# Altium schematic sheet 4-ADC.SchDoc: RD15002_SingleSCT.PrjPcb
size A4; DrawnBy: 邓勇杰; Revision: A1.0.0; SheetNumber: 5; SheetTotal: 10; Time: 2015/12/2
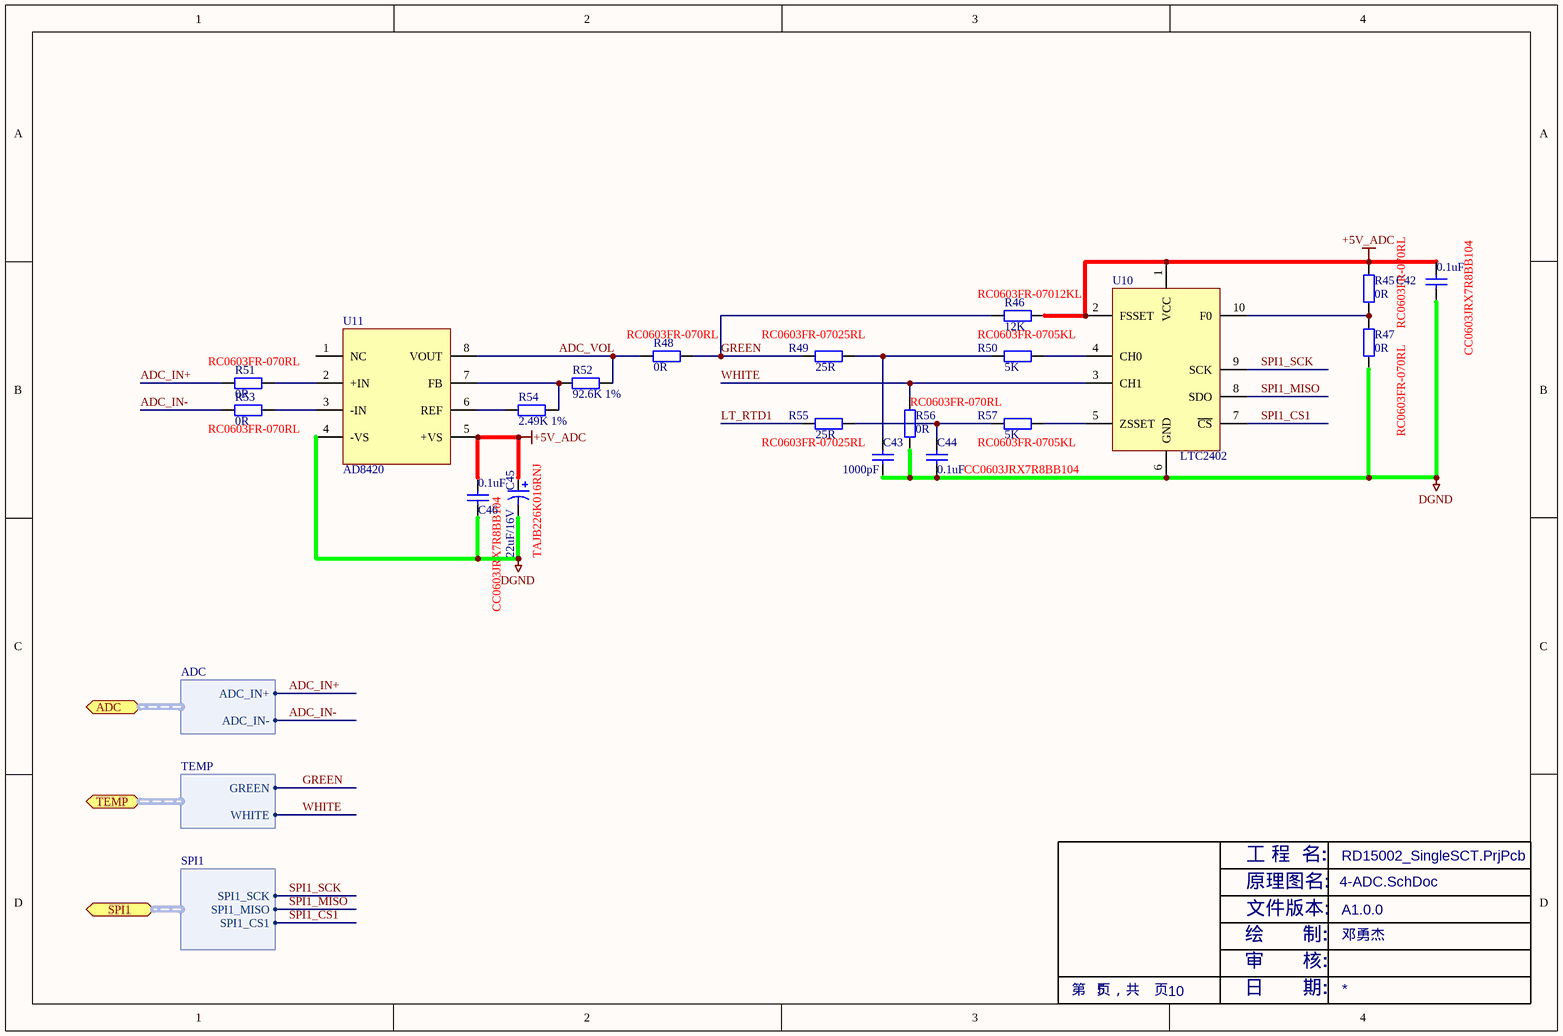
[diagram p0: 4-ADC.SchDoc]

## Parts
C42  0.1uF  Type No.: CC0603JRX7R8BB104  [CC0603]
C43  1000pF  [CC0603]
C44  0.1uF  Type No.: CC0603JRX7R8BB104  [CC0603]
C45  22uF/16V  Part No.: TAJB226K016RNJ  [CB3528]
C46  0.1uF  Type No.: CC0603JRX7R8BB104  [CC0603]
R45  0R  Type No.: RC0603FR-070RL  [CC0603]
R46  12K  Type No.: RC0603FR-07012KL  [CC0603]
R47  0R  Type No.: RC0603FR-070RL  [CC0603]
R48  0R  Type No.: RC0603FR-070RL  [CC0603]
R49  25R  Type No.: RC0603FR-07025RL  [CC0603]
R50  5K  Type No.: RC0603FR-0705KL  [CC0603]
R51  0R  Type No.: RC0603FR-070RL  [CC0603]
R52  92.6K 1%  [CC0603]
R53  0R  Type No.: RC0603FR-070RL  [CC0603]
R54  2.49K 1%  [CC0603]
R55  25R  Type No.: RC0603FR-07025RL  [CC0603]
R56  0R  Type No.: RC0603FR-070RL  [CC0603]
R57  5K  Type No.: RC0603FR-0705KL  [CC0603]
U10  LTC2402  [MS10]
U11  AD8420  [MSOP8]

## Ports
ADC (harness ADC), SPI1 (harness SPI1), TEMP (harness TEMP)

## Harnesses
SPI1: SPI1_SCK, SPI1_MISO, SPI1_CS1
TEMP: GREEN, WHITE
ADC: ADC_IN+, ADC_IN-

## Nets
+5V_ADC: C42.2 C45.1 C46.2 R45.1 R46.1 U10.1(VCC) U10.2(FSSET) U11.5(+VS)
DGND: C42.1 C43.1 C44.1 C45.2 C46.1 R47.2 R56.1 U10.6(GND) U11.4(-VS)
ADC_IN+: R51.1 ; port ADC.ADC_IN+
ADC_IN-: R53.1 ; port ADC.ADC_IN-
ADC_VOL: R48.1 R52.2 U11.8(VOUT)
GREEN: R46.2 R48.2 R49.1 ; port TEMP.GREEN
LT_RTD1: R55.1
SPI1_CS1: U10.7(~{CS}) ; port SPI1.SPI1_CS1
SPI1_MISO: U10.8(SDO) ; port SPI1.SPI1_MISO
SPI1_SCK: U10.9(SCK) ; port SPI1.SPI1_SCK
WHITE: R56.2 U10.3(CH1) ; port TEMP.WHITE
NetC43_2: C43.2 R49.2 R50.1
NetC44_2: C44.2 R55.2 R57.1
NetR45_2: R45.2 R47.1 U10.10(F0)
NetR50_2: R50.2 U10.4(CH0)
NetR51_2: R51.2 U11.2(+IN)
NetR52_1: R52.1 R54.2 U11.7(FB)
NetR53_2: R53.2 U11.3(-IN)
NetR54_1: R54.1 U11.6(REF)
NetR57_2: R57.2 U10.5(ZSSET)

Not connected (* = marked no-connect by the designer): U11 1(NC)

## Notes on the sheet
- 文件版本:
- 原理图名:
- 工 程  名:
- 绘       制:
- 审       核:
- 第   页，共    页
- 日       期:

## Library data of the parts
C42-C44 C46 = Cap: Capacitor
C45 = Cap Pol1: Polarized Capacitor (Radial)
R45-R51 R53 R55-R57 = Res2: Resistor
R52 R54 = Res2: Resistor; Value: 1K; Published: 8-Jun-2000; LatestRevisionDate: 17-Jul-2002; LatestRevisionNote: Re-released for DXP Platform.; PackageReference: AXIAL-0.4; Publisher: Altium Limited